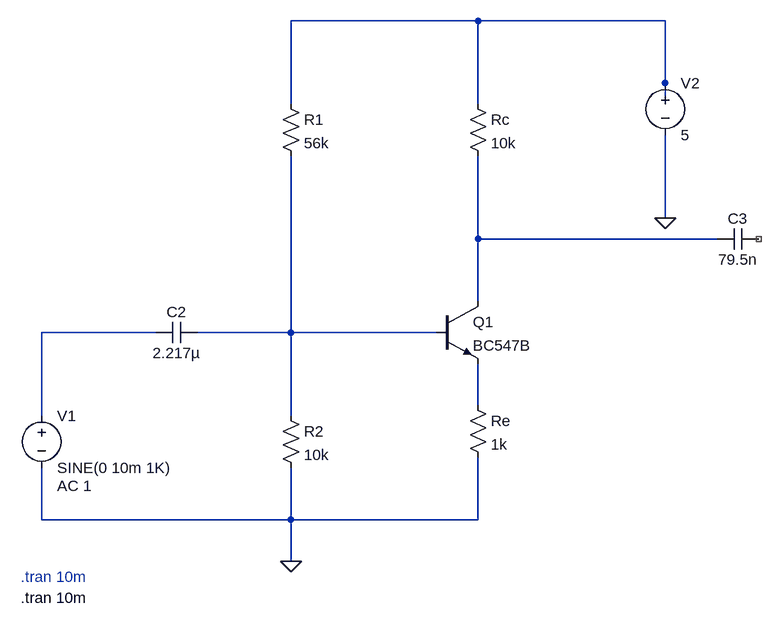
[diagram p0: schematic gain.asc]
gain.asc, the LTspice schematic file:
Version 4
SHEET 1 1556 680
WIRE 688 -480 400 -480
WIRE 976 -480 688 -480
WIRE 976 -384 976 -480
WIRE 400 -352 400 -480
WIRE 688 -352 688 -480
WIRE 976 -352 976 -384
WIRE 976 -176 976 -304
WIRE 688 -144 688 -272
WIRE 1056 -144 688 -144
WIRE 688 -48 688 -144
WIRE 192 0 16 0
WIRE 400 0 400 -272
WIRE 400 0 256 0
WIRE 624 0 400 0
WIRE 688 112 688 48
WIRE 16 128 16 0
WIRE 400 128 400 0
WIRE 16 288 16 208
WIRE 400 288 400 208
WIRE 400 288 16 288
WIRE 688 288 688 192
WIRE 688 288 400 288
WIRE 400 352 400 288
FLAG 400 352 0
FLAG 976 -176 0
DATAFLAG 688 80 ""
DATAFLAG 400 0 ""
SYMBOL voltage 16 112 R0
WINDOW 123 24 124 Left 2
WINDOW 39 0 0 Left 0
SYMATTR Value2 AC 1
SYMATTR InstName V1
SYMATTR Value SINE(0 10m 1K)
SYMBOL cap 256 -16 R90
WINDOW 0 0 32 VBottom 2
WINDOW 3 32 32 VTop 2
SYMATTR InstName C2
SYMATTR Value 2.217µ
SYMBOL res 384 112 R0
SYMATTR InstName R2
SYMATTR Value 10k
SYMBOL res 384 -368 R0
SYMATTR InstName R1
SYMATTR Value 56k
SYMBOL voltage 976 -400 R0
WINDOW 123 0 0 Left 0
WINDOW 39 0 0 Left 0
SYMATTR InstName V2
SYMATTR Value 5
SYMBOL res 672 -368 R0
SYMATTR InstName Rc
SYMATTR Value 10k
SYMBOL cap 1120 -160 R90
WINDOW 0 0 32 VBottom 2
WINDOW 3 32 32 VTop 2
SYMATTR InstName C3
SYMATTR Value 79.5n
SYMBOL res 672 96 R0
SYMATTR InstName Re
SYMATTR Value 1k
SYMBOL npn 624 -48 R0
SYMATTR InstName Q1
SYMATTR Value BC547B
TEXT -16 376 Left 2 ;.tran 10m
TEXT -16 408 Left 2 !.tran 10m

The netlist it stands for:
* gain.asc
V1 N003 0 SINE(0 10m 1K) AC 1
C2 N004 N003 2.217µ
R2 N004 0 10k
R1 N001 N004 56k
V2 N001 0 5
Rc N001 N002 10k
C3 NC_01 N002 79.5n
Re N005 0 1k
Q1 N002 N004 N005 0 BC547B
.model NPN NPN
.model PNP PNP
.lib standard.bjt
* .tran 10m
.tran 10m
.backanno
.end